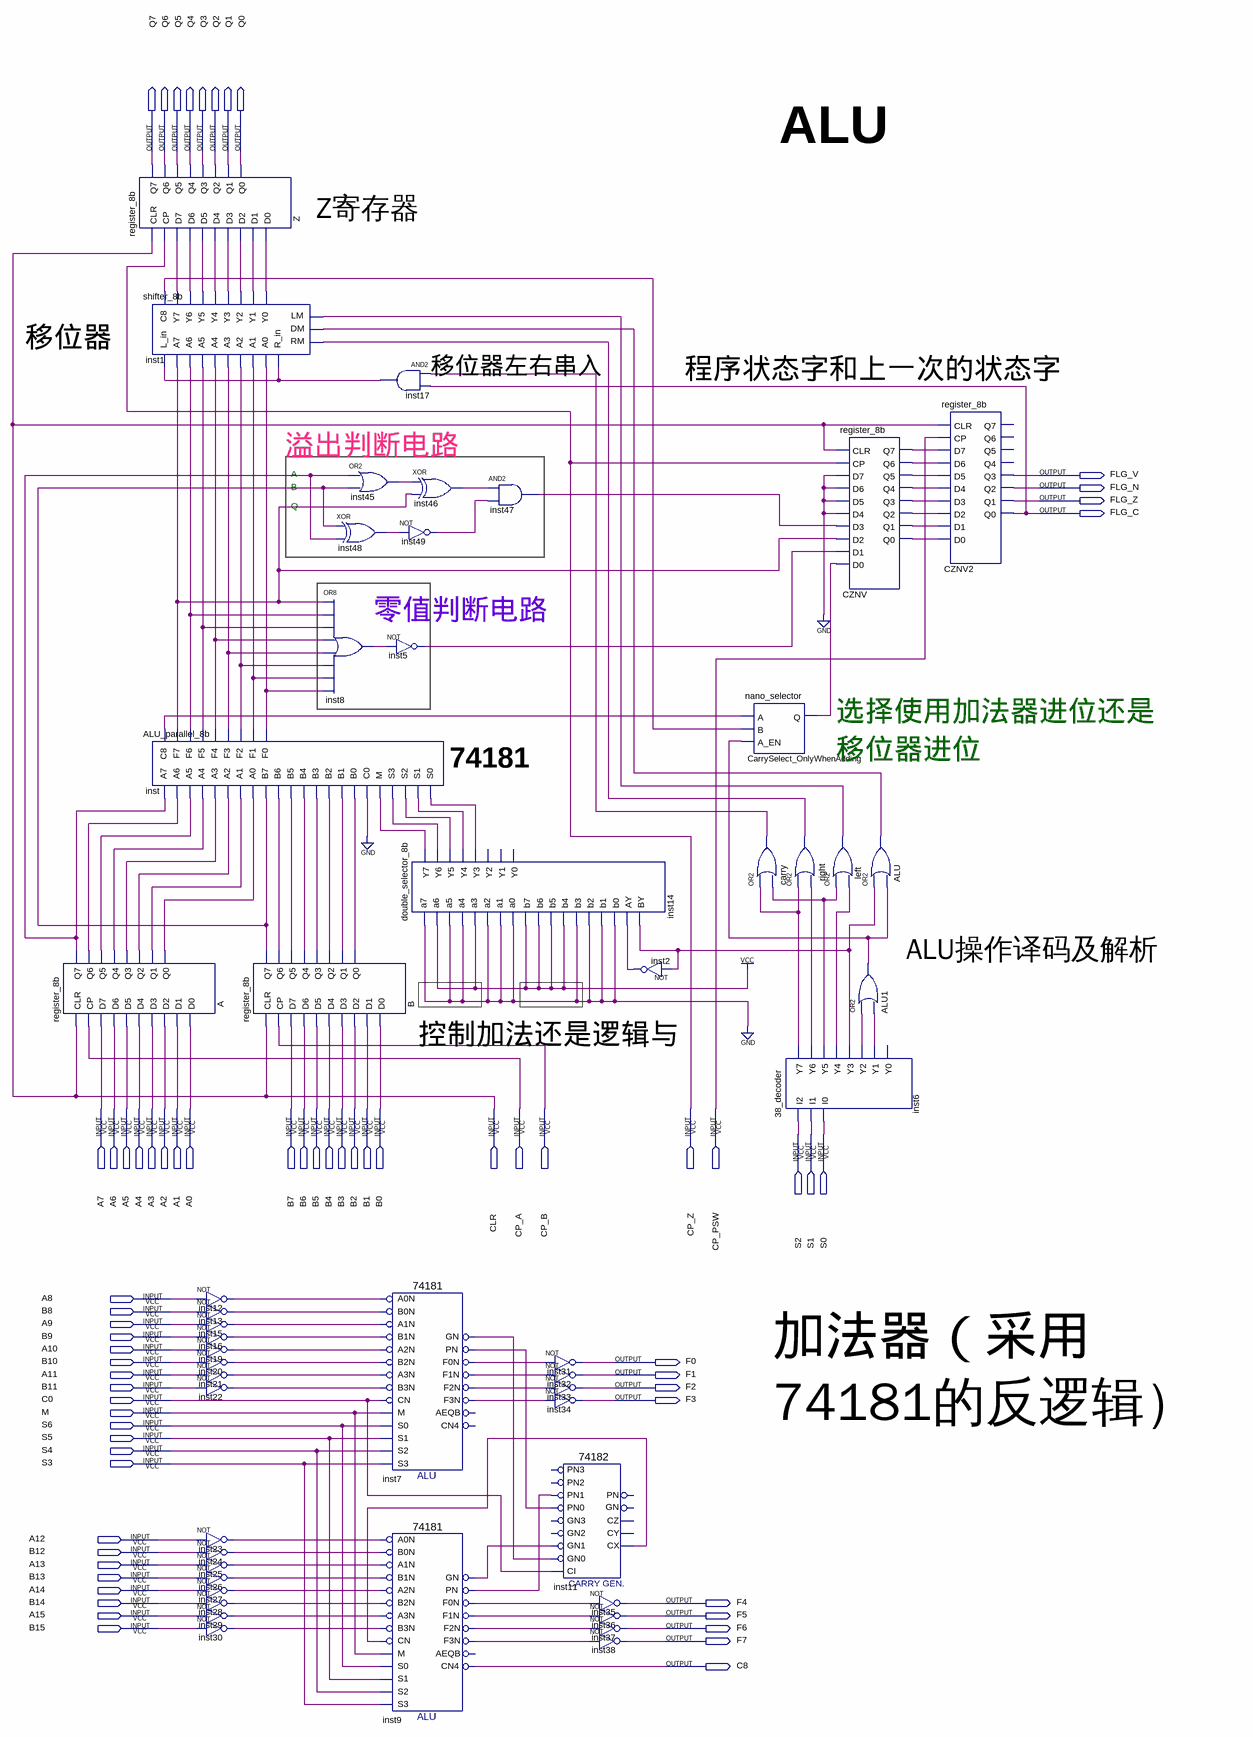
[diagram p0: schematic sheet]
// Quartus schematic print2.bdf as structural Verilog: 51 symbols, 67 pins
module print2 (
  input  A7,
  input  A6,
  input  A5,
  input  A4,
  input  A3,
  input  A2,
  input  A1,
  input  A0,
  input  B7,
  input  B6,
  input  B5,
  input  B4,
  input  B3,
  input  B2,
  input  B1,
  input  B0,
  input  CLR,
  input  CP_A,
  input  CP_B,
  input  CP_Z,
  input  CP_PSW,
  input  S2,
  input  S1,
  input  S0,
  input  A8,
  input  B8,
  input  A9,
  input  B9,
  input  A10,
  input  B10,
  input  A11,
  input  B11,
  input  C0,
  input  M,
  input  S6,
  input  S5,
  input  S4,
  input  S3,
  input  A12,
  input  B12,
  input  A13,
  input  B13,
  input  A14,
  input  B14,
  input  A15,
  input  B15,
  output Q7,
  output Q6,
  output Q5,
  output Q4,
  output Q3,
  output Q2,
  output Q1,
  output Q0,
  output FLG_V,
  output FLG_N,
  output FLG_Z,
  output FLG_C,
  output F0,
  output F1,
  output F2,
  output F3,
  output F4,
  output F5,
  output F6,
  output F7,
  output C8
);

  wire A_q0, A_q1, A_q2, A_q3, A_q4, A_q5, A_q6, A_q7, ALU1_out, ALU_out, B_q0, B_q1, B_q2, B_q3, B_q4, B_q5,
       B_q6, B_q7, carry_out, CarrySelect_OnlyWhenAdding_q, CZNV_q0, CZNV_q1, CZNV_q2, CZNV_q3, CZNV_q4,
       CZNV_q5, CZNV_q6, CZNV_q7, inst1_c8, inst1_y0, inst1_y1, inst1_y2, inst1_y3, inst1_y4, inst1_y5,
       inst1_y6, inst1_y7, inst2_out, inst5_out, inst6_y1, inst6_y2, inst6_y3, inst6_y4, inst6_y5, inst6_y6,
       inst6_y7, inst7_f0n, inst7_f1n, inst7_f2n, inst7_f3n, inst7_gn, inst7_pn, inst8_out, inst9_f0n,
       inst9_f1n, inst9_f2n, inst9_f3n, inst9_gn, inst9_pn, inst11_cx, inst12_out, inst13_out, inst14_y3,
       inst14_y4, inst14_y5, inst14_y6, inst14_y7, inst15_out, inst16_out, inst17_out, inst19_out,
       inst20_out, inst21_out, inst22_out, inst23_out, inst24_out, inst25_out, inst26_out, inst27_out,
       inst28_out, inst29_out, inst30_out, inst45_out, inst46_out, inst47_out, inst48_out, inst49_out,
       inst_c8, inst_f0, inst_f1, inst_f2, inst_f3, inst_f4, inst_f5, inst_f6, inst_f7, left_out, right_out;

  register_8b A (
    .CLR(CLR), .CP(CP_A), .D7(A7), .D6(A6), .D5(A5), .D4(A4), .D3(A3), .D2(A2), .D1(A1), .D0(A0), .Q7(A_q7),
    .Q6(A_q6), .Q5(A_q5), .Q4(A_q4), .Q3(A_q3), .Q2(A_q2), .Q1(A_q1), .Q0(A_q0));
  register_8b Z (
    .CLR(CLR), .CP(CP_Z), .D7(inst1_y7), .D6(inst1_y6), .D5(inst1_y5), .D4(inst1_y4), .D3(inst1_y3),
    .D2(inst1_y2), .D1(inst1_y1), .D0(inst1_y0), .Q7(Q7), .Q6(Q6), .Q5(Q5), .Q4(Q4), .Q3(Q3), .Q2(Q2),
    .Q1(Q1), .Q0(Q0));
  shifter_8b inst1 (
    .A7(inst_f7), .A6(inst_f6), .A5(inst_f5), .A4(inst_f4), .A3(inst_f3), .A2(inst_f2), .A1(inst_f1),
    .A0(inst_f0), .LM(left_out), .DM(ALU_out), .RM(right_out), .R_in(inst17_out), .L_in(inst17_out),
    .Y7(inst1_y7), .Y6(inst1_y6), .Y5(inst1_y5), .Y4(inst1_y4), .Y3(inst1_y3), .Y2(inst1_y2), .Y1(inst1_y1),
    .Y0(inst1_y0), .C8(inst1_c8));
  ALU_parallel_8b inst (
    .A0(A_q0), .B0(B_q0), .A1(A_q1), .B1(B_q1), .A2(A_q2), .B2(B_q2), .A3(A_q3), .B3(B_q3), .C0(1'b0),
    .M(inst14_y7), .S3(inst14_y6), .S2(inst14_y5), .S1(inst14_y4), .S0(inst14_y3), .A4(A_q4), .B4(B_q4),
    .A5(A_q5), .B5(B_q5), .A6(A_q6), .B6(B_q6), .A7(A_q7), .B7(B_q7), .F0(inst_f0), .F1(inst_f1),
    .F2(inst_f2), .F3(inst_f3), .C8(inst_c8), .F4(inst_f4), .F5(inst_f5), .F6(inst_f6), .F7(inst_f7));
  not inst12 (inst12_out, A8);
  not inst13 (inst13_out, B8);
  not inst15 (inst15_out, A9);
  not inst16 (inst16_out, B9);
  not inst19 (inst19_out, A10);
  not inst20 (inst20_out, B10);
  not inst21 (inst21_out, A11);
  not inst22 (inst22_out, B11);
  not inst23 (inst23_out, A12);
  not inst24 (inst24_out, B12);
  not inst25 (inst25_out, A13);
  not inst26 (inst26_out, B13);
  not inst27 (inst27_out, A14);
  not inst28 (inst28_out, B14);
  not inst29 (inst29_out, A15);
  not inst30 (inst30_out, B15);
  register_8b B (
    .CLR(CLR), .CP(CP_B), .D7(B7), .D6(B6), .D5(B5), .D4(B4), .D3(B3), .D2(B2), .D1(B1), .D0(B0), .Q7(B_q7),
    .Q6(B_q6), .Q5(B_q5), .Q4(B_q4), .Q3(B_q3), .Q2(B_q2), .Q1(B_q1), .Q0(B_q0));
  or inst45 (inst45_out, A_q7, B_q7);
  xor inst48 (inst48_out, B_q7, A_q7);
  or inst8 (inst8_out, inst_f7, inst_f6, inst_f5, inst_f4, inst_f3, inst_f2, inst_f1, inst_f0);
  and inst17 (inst17_out, carry_out, FLG_C);
  not inst49 (inst49_out, inst48_out);
  not inst5 (inst5_out, inst8_out);
  double_selector_8b inst14 (
    .a0(1'b0), .a1(1'b0), .a2(1'b0), .a3(1'b1), .a4(1'b0), .a5(1'b0), .a6(1'b1), .a7(1'b0), .b0(1'b0),
    .b1(1'b0), .b2(1'b0), .b3(1'b0), .b4(1'b1), .b5(1'b1), .b6(1'b1), .b7(1'b1), .AY(inst2_out),
    .BY(inst6_y3), .Y3(inst14_y3), .Y4(inst14_y4), .Y5(inst14_y5), .Y6(inst14_y6), .Y7(inst14_y7));  // open: Y0, Y1, Y2
  \74181  inst7 (
    .B0N(inst13_out), .A0N(inst12_out), .A1N(inst15_out), .B1N(inst16_out), .A3N(inst21_out),
    .B2N(inst20_out), .A2N(inst19_out), .M(M), .CN(C0), .B3N(inst22_out), .S2(S4), .S1(S5), .S0(S6), .S3(S3),
    .PN(inst7_pn), .GN(inst7_gn), .F3N(inst7_f3n), .F1N(inst7_f1n), .F0N(inst7_f0n), .F2N(inst7_f2n));  // open: AEQB, CN4
  \74181  inst9 (
    .B0N(inst24_out), .A0N(inst23_out), .A1N(inst25_out), .B1N(inst26_out), .A3N(inst29_out),
    .B2N(inst28_out), .A2N(inst27_out), .M(M), .CN(inst11_cx), .B3N(inst30_out), .S2(S4), .S1(S5), .S0(S6),
    .S3(S3), .PN(inst9_pn), .GN(inst9_gn), .F3N(inst9_f3n), .F1N(inst9_f1n), .F0N(inst9_f0n), .CN4(C8),
    .F2N(inst9_f2n));  // open: AEQB
  xor inst46 (inst46_out, inst45_out, inst_f7);
  and inst47 (inst47_out, inst46_out, inst49_out);
  not inst31 (F0, inst7_f0n);
  not inst32 (F1, inst7_f1n);
  not inst33 (F2, inst7_f2n);
  not inst34 (F3, inst7_f3n);
  \74182  inst11 (
    .CI(C0), .PN1(inst9_pn), .PN0(inst7_pn), .GN1(inst9_gn), .GN0(inst7_gn), .CX(inst11_cx));  // open: PN2, GN2, GN3, PN3, CY, PN, CZ, GN
  not inst35 (F4, inst9_f0n);
  not inst36 (F5, inst9_f1n);
  not inst37 (F6, inst9_f2n);
  not inst38 (F7, inst9_f3n);
  not inst2 (inst2_out, inst6_y3);
  nano_selector CarrySelect_OnlyWhenAdding (
    .A(inst_c8), .B(inst1_c8), .A_EN(ALU1_out), .Q(CarrySelect_OnlyWhenAdding_q));
  or carry (carry_out, inst6_y7, inst6_y5);
  or right (right_out, inst6_y7, inst6_y6);
  \38_decoder  inst6 (
    .I2(S2), .I1(S1), .I0(S0), .Y7(inst6_y7), .Y6(inst6_y6), .Y5(inst6_y5), .Y4(inst6_y4), .Y3(inst6_y3),
    .Y2(inst6_y2), .Y1(inst6_y1));  // open: Y0
  register_8b CZNV (
    .CLR(CLR), .CP(CP_Z), .D7(1'b0), .D6(1'b0), .D5(1'b0), .D4(1'b0), .D3(inst47_out), .D2(inst_f7),
    .D1(inst5_out), .D0(CarrySelect_OnlyWhenAdding_q), .Q7(CZNV_q7), .Q6(CZNV_q6), .Q5(CZNV_q5),
    .Q4(CZNV_q4), .Q3(CZNV_q3), .Q2(CZNV_q2), .Q1(CZNV_q1), .Q0(CZNV_q0));
  or ALU (ALU_out, inst6_y3, ALU1_out);
  or left (left_out, inst6_y5, inst6_y4);
  or ALU1 (ALU1_out, inst6_y2, inst6_y1);
  register_8b CZNV2 (
    .CLR(CLR), .CP(CP_PSW), .D7(CZNV_q7), .D6(CZNV_q6), .D5(CZNV_q5), .D4(CZNV_q4), .D3(CZNV_q3),
    .D2(CZNV_q2), .D1(CZNV_q1), .D0(CZNV_q0), .Q3(FLG_V), .Q2(FLG_N), .Q1(FLG_Z), .Q0(FLG_C));  // open: Q7, Q6, Q5, Q4

  // Notes on the sheet:
  //   ALU
  //   Z寄存器
  //   移位器
  //   移位器左右串入
  //   程序状态字和上一次的状态字
  //   溢出判断电路
  //   A
  //   B
  //   Q
  //   零值判断电路
  //   选择使用加法器进位还是
  //   移位器进位
  //   74181
  //   ALU操作译码及解析
  //   控制加法还是逻辑与
  //   加法器（采用
  //   74181的反逻辑）
endmodule
